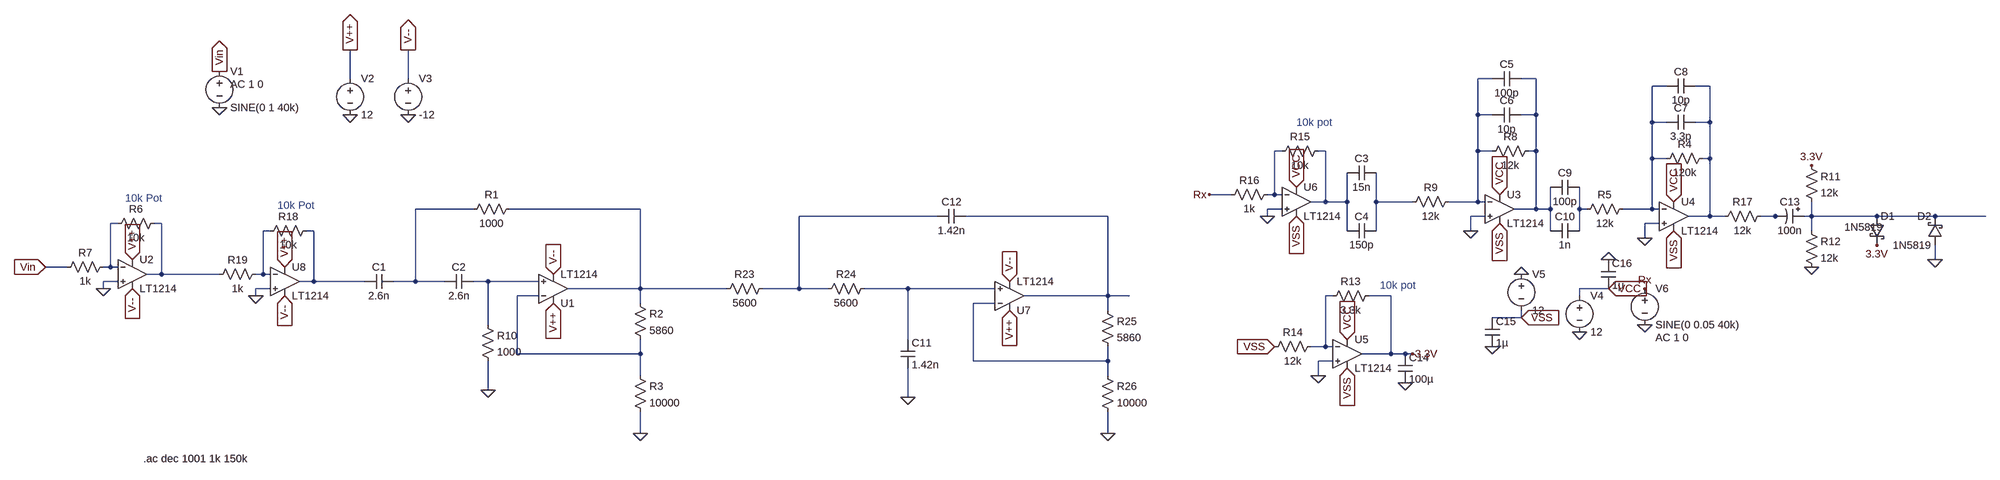
[diagram p0: schematic draftBandpassCascade.asc]
draftBandpassCascade.asc, the LTspice schematic file:
Version 4
SHEET 1 5380 1108
WIRE -16 -320 -16 -384
WIRE 112 -320 112 -384
WIRE 3056 -320 3024 -320
WIRE 3152 -320 3120 -320
WIRE 3440 -304 3408 -304
WIRE 3536 -304 3504 -304
WIRE 3024 -240 3024 -320
WIRE 3056 -240 3024 -240
WIRE 3152 -240 3152 -320
WIRE 3152 -240 3120 -240
WIRE 3408 -224 3408 -304
WIRE 3440 -224 3408 -224
WIRE 3536 -224 3536 -304
WIRE 3536 -224 3504 -224
WIRE 2592 -160 2576 -160
WIRE 2688 -160 2672 -160
WIRE 3024 -160 3024 -240
WIRE 3056 -160 3024 -160
WIRE 3152 -160 3152 -240
WIRE 3152 -160 3136 -160
WIRE 3408 -144 3408 -224
WIRE 3440 -144 3408 -144
WIRE 3536 -144 3536 -224
WIRE 3536 -144 3520 -144
WIRE 2480 -64 2432 -64
WIRE 2576 -64 2576 -160
WIRE 2576 -64 2560 -64
WIRE 2592 -64 2576 -64
WIRE 2688 -48 2688 -160
WIRE 2688 -48 2656 -48
WIRE 2736 -48 2736 -112
WIRE 2736 -48 2688 -48
WIRE 2800 -48 2800 -112
WIRE 2880 -48 2800 -48
WIRE 3024 -48 3024 -160
WIRE 3024 -48 2960 -48
WIRE 3040 -48 3024 -48
WIRE 256 -32 128 -32
WIRE 624 -32 336 -32
WIRE 2592 -32 2560 -32
WIRE 3152 -32 3152 -160
WIRE 3152 -32 3104 -32
WIRE 3184 -32 3184 -80
WIRE 3184 -32 3152 -32
WIRE 3248 -32 3248 -80
WIRE 3264 -32 3248 -32
WIRE 3408 -32 3408 -144
WIRE 3408 -32 3344 -32
WIRE 3424 -32 3408 -32
WIRE 1488 -16 1184 -16
WIRE 1888 -16 1552 -16
WIRE 2560 -16 2560 -32
WIRE 3040 -16 3008 -16
WIRE 3536 -16 3536 -144
WIRE 3536 -16 3488 -16
WIRE 3568 -16 3536 -16
WIRE 3680 -16 3648 -16
WIRE 3696 -16 3680 -16
WIRE 3760 -16 3760 -48
WIRE 3760 -16 3744 -16
WIRE 3904 -16 3760 -16
WIRE 4032 -16 3904 -16
WIRE 4144 -16 4032 -16
WIRE -528 0 -544 0
WIRE -432 0 -448 0
WIRE 3424 0 3392 0
WIRE -192 16 -208 16
WIRE -96 16 -112 16
WIRE 2736 16 2736 -48
WIRE 2800 16 2800 -48
WIRE 3008 16 3008 -16
WIRE 3184 16 3184 -32
WIRE 3248 16 3248 -32
WIRE 3760 16 3760 -16
WIRE 3392 32 3392 0
WIRE 4032 80 4032 48
WIRE -640 96 -688 96
WIRE -544 96 -544 0
WIRE -544 96 -560 96
WIRE -528 96 -544 96
WIRE -432 112 -432 0
WIRE -432 112 -464 112
WIRE -304 112 -432 112
WIRE -208 112 -208 16
WIRE -208 112 -224 112
WIRE -192 112 -208 112
WIRE -528 128 -560 128
WIRE -96 128 -96 16
WIRE -96 128 -128 128
WIRE 16 128 -96 128
WIRE 128 128 128 -32
WIRE 128 128 80 128
WIRE 192 128 128 128
WIRE 288 128 256 128
WIRE 400 128 288 128
WIRE -560 144 -560 128
WIRE -192 144 -224 144
WIRE 624 144 624 -32
WIRE 624 144 464 144
WIRE 1024 144 624 144
WIRE 1184 144 1184 -16
WIRE 1184 144 1104 144
WIRE 1248 144 1184 144
WIRE 1424 144 1328 144
WIRE 1616 144 1424 144
WIRE 3312 144 3248 144
WIRE -224 160 -224 144
WIRE 400 160 352 160
WIRE 1888 160 1888 -16
WIRE 1888 160 1680 160
WIRE 1936 160 1888 160
WIRE 2704 160 2688 160
WIRE 2832 160 2784 160
WIRE 3248 160 3248 144
WIRE 624 176 624 144
WIRE 1616 176 1568 176
WIRE 1888 192 1888 160
WIRE 3120 208 3120 192
WIRE 3120 208 3056 208
WIRE 288 224 288 128
WIRE 1424 256 1424 144
WIRE 2688 272 2688 160
WIRE 2688 272 2656 272
WIRE 2704 272 2688 272
WIRE 352 288 352 160
WIRE 624 288 624 256
WIRE 624 288 352 288
WIRE 2832 288 2832 160
WIRE 2832 288 2768 288
WIRE 2864 288 2832 288
WIRE 2880 288 2864 288
WIRE 1568 304 1568 176
WIRE 1888 304 1888 272
WIRE 1888 304 1568 304
WIRE 2704 304 2672 304
WIRE 624 336 624 288
WIRE 1888 336 1888 304
WIRE 2672 336 2672 304
WIRE 288 368 288 304
WIRE 1424 384 1424 320
WIRE 624 464 624 416
WIRE 1888 464 1888 416
FLAG -16 -240 0
FLAG 112 -240 0
FLAG -16 -384 V++
IOPIN -16 -384 Out
FLAG 112 -384 V--
IOPIN 112 -384 Out
FLAG -304 -256 0
FLAG -304 -336 Vin
IOPIN -304 -336 Out
FLAG -560 144 0
FLAG -496 144 V--
IOPIN -496 144 In
FLAG -496 80 V++
IOPIN -496 80 In
FLAG -688 96 Vin
IOPIN -688 96 In
FLAG 432 112 V--
IOPIN 432 112 In
FLAG 432 176 V++
IOPIN 432 176 In
FLAG 624 464 0
FLAG 288 368 0
FLAG 1424 384 0
FLAG 1648 128 V--
IOPIN 1648 128 In
FLAG 1648 192 V++
IOPIN 1648 192 In
FLAG 1888 464 0
FLAG 3392 32 0
FLAG 3248 240 0
FLAG 3120 112 0
FLAG 3456 -48 VCC
IOPIN 3456 -48 In
FLAG 3456 16 VSS
IOPIN 3456 16 In
FLAG 3392 224 0
FLAG 3008 16 0
FLAG 3072 -64 VCC
IOPIN 3072 -64 In
FLAG 3072 0 VSS
IOPIN 3072 0 In
FLAG 3760 96 0
FLAG 3760 -128 3.3V
FLAG 2880 288 3.3V
FLAG 2672 336 0
FLAG 2736 256 VCC
IOPIN 2736 256 In
FLAG 2736 320 VSS
IOPIN 2736 320 In
FLAG 2576 272 VSS
IOPIN 2576 272 In
FLAG 3392 144 Rx
FLAG 4032 80 0
FLAG 3904 48 3.3V
FLAG 2560 -16 0
FLAG 2432 -64 Rx
FLAG 2624 -16 VSS
IOPIN 2624 -16 In
FLAG 2624 -80 VCC
IOPIN 2624 -80 In
FLAG 2864 352 0
FLAG 3056 272 0
FLAG 3312 80 0
FLAG 3120 208 VSS
IOPIN 3120 208 In
FLAG 3312 144 VCC
IOPIN 3312 144 In
FLAG -224 160 0
FLAG -160 160 V--
IOPIN -160 160 In
FLAG -160 96 V++
IOPIN -160 96 In
SYMBOL voltage -16 -336 R0
WINDOW 123 0 0 Left 0
WINDOW 39 0 0 Left 0
SYMATTR InstName V2
SYMATTR Value 12
SYMBOL voltage 112 -336 R0
WINDOW 123 0 0 Left 0
WINDOW 39 0 0 Left 0
SYMATTR InstName V3
SYMATTR Value -12
SYMBOL voltage -304 -352 R0
WINDOW 123 24 44 Left 2
WINDOW 39 0 0 Left 0
SYMATTR Value2 AC 1 0
SYMATTR InstName V1
SYMATTR Value SINE(0 1 40k)
SYMBOL Opamps\\LT1214 -496 48 R0
SYMATTR InstName U2
SYMBOL res -432 -16 R90
WINDOW 0 0 56 VBottom 2
WINDOW 3 32 56 VTop 2
SYMATTR InstName R6
SYMATTR Value 10k
SYMBOL res -544 80 R90
WINDOW 0 0 56 VBottom 2
WINDOW 3 32 56 VTop 2
SYMATTR InstName R7
SYMATTR Value 1k
SYMBOL cap 80 112 R90
WINDOW 0 0 32 VBottom 2
WINDOW 3 32 32 VTop 2
SYMATTR InstName C1
SYMATTR Value 2.6n
SYMBOL cap 256 112 R90
WINDOW 0 0 32 VBottom 2
WINDOW 3 32 32 VTop 2
SYMATTR InstName C2
SYMATTR Value 2.6n
SYMBOL Opamps\\LT1214 432 208 M180
SYMATTR InstName U1
SYMBOL res 352 -48 R90
WINDOW 0 0 56 VBottom 2
WINDOW 3 32 56 VTop 2
SYMATTR InstName R1
SYMATTR Value 1000
SYMBOL res 608 160 R0
SYMATTR InstName R2
SYMATTR Value 5860
SYMBOL res 608 320 R0
SYMATTR InstName R3
SYMATTR Value 10000
SYMBOL res 272 208 R0
SYMATTR InstName R10
SYMATTR Value 1000
SYMBOL res 1120 128 R90
WINDOW 0 0 56 VBottom 2
WINDOW 3 32 56 VTop 2
SYMATTR InstName R23
SYMATTR Value 5600
SYMBOL res 1344 128 R90
WINDOW 0 0 56 VBottom 2
WINDOW 3 32 56 VTop 2
SYMATTR InstName R24
SYMATTR Value 5600
SYMBOL cap 1408 256 R0
SYMATTR InstName C11
SYMATTR Value 1.42n
SYMBOL cap 1552 -32 R90
WINDOW 0 0 32 VBottom 2
WINDOW 3 32 32 VTop 2
SYMATTR InstName C12
SYMATTR Value 1.42n
SYMBOL Opamps\\LT1214 1648 224 M180
SYMATTR InstName U7
SYMBOL res 1872 176 R0
SYMATTR InstName R25
SYMATTR Value 5860
SYMBOL res 1872 320 R0
SYMATTR InstName R26
SYMATTR Value 10000
SYMBOL voltage 3248 144 R0
WINDOW 123 0 0 Left 0
WINDOW 39 0 0 Left 0
SYMATTR InstName V4
SYMATTR Value 12
SYMBOL voltage 3120 96 R0
WINDOW 123 0 0 Left 0
WINDOW 39 0 0 Left 0
SYMATTR InstName V5
SYMATTR Value 12
SYMBOL res 3536 -160 R90
WINDOW 0 0 56 VBottom 2
WINDOW 3 32 56 VTop 2
SYMATTR InstName R4
SYMATTR Value 120k
SYMBOL res 3360 -48 R90
WINDOW 0 0 56 VBottom 2
WINDOW 3 32 56 VTop 2
SYMATTR InstName R5
SYMATTR Value 12k
SYMBOL res 3152 -176 R90
WINDOW 0 0 56 VBottom 2
WINDOW 3 32 56 VTop 2
SYMATTR InstName R8
SYMATTR Value 12k
SYMBOL res 2976 -64 R90
WINDOW 0 0 56 VBottom 2
WINDOW 3 32 56 VTop 2
SYMATTR InstName R9
SYMATTR Value 12k
SYMBOL Opamps\\LT1214 3072 -96 R0
SYMATTR InstName U3
SYMBOL Opamps\\LT1214 3456 -80 R0
SYMATTR InstName U4
SYMBOL cap 2800 -128 R90
WINDOW 0 0 32 VBottom 2
WINDOW 3 32 32 VTop 2
SYMATTR InstName C3
SYMATTR Value 15n
SYMBOL cap 2800 0 R90
WINDOW 0 0 32 VBottom 2
WINDOW 3 32 32 VTop 2
SYMATTR InstName C4
SYMATTR Value 150p
SYMBOL cap 3120 -336 R90
WINDOW 0 0 32 VBottom 2
WINDOW 3 32 32 VTop 2
SYMATTR InstName C5
SYMATTR Value 100p
SYMBOL cap 3120 -256 R90
WINDOW 0 0 32 VBottom 2
WINDOW 3 32 32 VTop 2
SYMATTR InstName C6
SYMATTR Value 10p
SYMBOL cap 3504 -240 R90
WINDOW 0 0 32 VBottom 2
WINDOW 3 32 32 VTop 2
SYMATTR InstName C7
SYMATTR Value 3.3p
SYMBOL cap 3504 -320 R90
WINDOW 0 0 32 VBottom 2
WINDOW 3 32 32 VTop 2
SYMATTR InstName C8
SYMATTR Value 10p
SYMBOL cap 3248 -96 R90
WINDOW 0 0 32 VBottom 2
WINDOW 3 32 32 VTop 2
SYMATTR InstName C9
SYMATTR Value 100p
SYMBOL cap 3248 0 R90
WINDOW 0 0 32 VBottom 2
WINDOW 3 32 32 VTop 2
SYMATTR InstName C10
SYMATTR Value 1n
SYMBOL polcap 3744 -32 R90
WINDOW 0 0 32 VBottom 2
WINDOW 3 32 32 VTop 2
SYMATTR InstName C13
SYMATTR Value 100n
SYMBOL res 3744 -144 R0
SYMATTR InstName R11
SYMATTR Value 12k
SYMBOL res 3744 0 R0
SYMATTR InstName R12
SYMATTR Value 12k
SYMBOL Opamps\\LT1214 2736 224 R0
SYMATTR InstName U5
SYMBOL res 2800 144 R90
WINDOW 0 0 56 VBottom 2
WINDOW 3 32 56 VTop 2
SYMATTR InstName R13
SYMATTR Value 3.3k
SYMBOL res 2672 256 R90
WINDOW 0 0 56 VBottom 2
WINDOW 3 32 56 VTop 2
SYMATTR InstName R14
SYMATTR Value 12k
SYMBOL voltage 3392 128 R0
WINDOW 123 24 124 Left 2
WINDOW 39 0 0 Left 0
SYMATTR Value2 AC 1 0
SYMATTR InstName V6
SYMATTR Value SINE(0 0.05 40k)
SYMBOL schottky 3888 -16 R0
WINDOW 3 -56 24 Left 2
SYMATTR Value 1N5819
SYMATTR InstName D1
SYMATTR Description Diode
SYMATTR Type diode
SYMBOL schottky 4048 48 R180
WINDOW 0 24 64 Left 2
WINDOW 3 24 0 Left 2
SYMATTR InstName D2
SYMATTR Value 1N5819
SYMATTR Description Diode
SYMATTR Type diode
SYMBOL Opamps\\LT1214 2624 -112 R0
SYMATTR InstName U6
SYMBOL res 2688 -176 R90
WINDOW 0 0 56 VBottom 2
WINDOW 3 32 56 VTop 2
SYMATTR InstName R15
SYMATTR Value 10k
SYMBOL res 2576 -80 R90
WINDOW 0 0 56 VBottom 2
WINDOW 3 32 56 VTop 2
SYMATTR InstName R16
SYMATTR Value 1k
SYMBOL cap 2848 288 R0
SYMATTR InstName C14
SYMATTR Value 100µ
SYMBOL res 3664 -32 R90
WINDOW 0 0 56 VBottom 2
WINDOW 3 32 56 VTop 2
SYMATTR InstName R17
SYMATTR Value 12k
SYMBOL cap 3040 208 R0
SYMATTR InstName C15
SYMATTR Value 1µ
SYMBOL cap 3296 80 R0
SYMATTR InstName C16
SYMATTR Value 1µ
SYMBOL Opamps\\LT1214 -160 64 R0
SYMATTR InstName U8
SYMBOL res -96 0 R90
WINDOW 0 0 56 VBottom 2
WINDOW 3 32 56 VTop 2
SYMATTR InstName R18
SYMATTR Value 10k
SYMBOL res -208 96 R90
WINDOW 0 0 56 VBottom 2
WINDOW 3 32 56 VTop 2
SYMATTR InstName R19
SYMATTR Value 1k
TEXT -472 520 Left 2 !.ac dec 1001 1k 150k
TEXT -512 -56 Left 2 ;10k Pot
TEXT 2624 -224 Left 2 ;10k pot
TEXT 2808 136 Left 2 ;10k pot
TEXT -176 -40 Left 2 ;10k Pot

The netlist it stands for:
* draftBandpassCascade.asc
V2 V++ 0 12
V3 V-- 0 -12
V1 Vin 0 SINE(0 1 40k) AC 1 0
XU2 0 N015 V++ V-- N016 LT1213  ; LT1214, pins In+ In- V+ V- OUT
R6 N016 N015 10k
R7 N015 Vin 1k
C1 N008 N018 2.6n
C2 N019 N008 2.6n
XU1 N019 N021 V++ V-- N009 LT1213  ; LT1214, pins In+ In- V+ V- OUT
R1 N009 N008 1000
R2 N009 N021 5860
R3 N021 0 10000
R10 N019 0 1000
R23 N011 N009 5600
R24 N020 N011 5600
C11 N020 0 1.42n
C12 N012 N011 1.42n
XU7 N020 N023 V++ V-- N012 LT1213  ; LT1214, pins In+ In- V+ V- OUT
R25 N012 N023 5860
R26 N023 0 10000
V4 VCC 0 12
V5 0 VSS 12
R4 N004 N003 120k
R5 N003 N010 12k
R8 N002 N001 12k
R9 N001 N007 12k
XU3 0 N001 VCC VSS N002 LT1213  ; LT1214, pins In+ In- V+ V- OUT
XU4 0 N003 VCC VSS N004 LT1213  ; LT1214, pins In+ In- V+ V- OUT
C3 N007 N006 15n
C4 N007 N006 150p
C5 N002 N001 100p
C6 N002 N001 10p
C7 N004 N003 3.3p
C8 N004 N003 10p
C9 N010 N002 100p
C10 N010 N002 1n
C13 N014 N013 100n
R11 3.3V N014 12k
R12 N014 0 12k
XU5 0 N022 VCC VSS 3.3V LT1213  ; LT1214, pins In+ In- V+ V- OUT
R13 3.3V N022 3.3k
R14 N022 VSS 12k
V6 Rx 0 SINE(0 0.05 40k) AC 1 0
D1 N014 3.3V 1N5819
D2 0 N014 1N5819
XU6 0 N005 VCC VSS N006 LT1213  ; LT1214, pins In+ In- V+ V- OUT
R15 N006 N005 10k
R16 N005 Rx 1k
C14 3.3V 0 100µ
R17 N013 N004 12k
C15 VSS 0 1µ
C16 0 VCC 1µ
XU8 0 N017 V++ V-- N018 LT1213  ; LT1214, pins In+ In- V+ V- OUT
R18 N018 N017 10k
R19 N017 N016 1k
.model D D
.lib standard.dio
.ac dec 1001 1k 150k
* 10k Pot
* 10k pot
* 10k pot
* 10k Pot
.lib LTC.lib
.backanno
.end